# Altium schematic sheet SchemaDriverMoteur.SchDoc
size A4
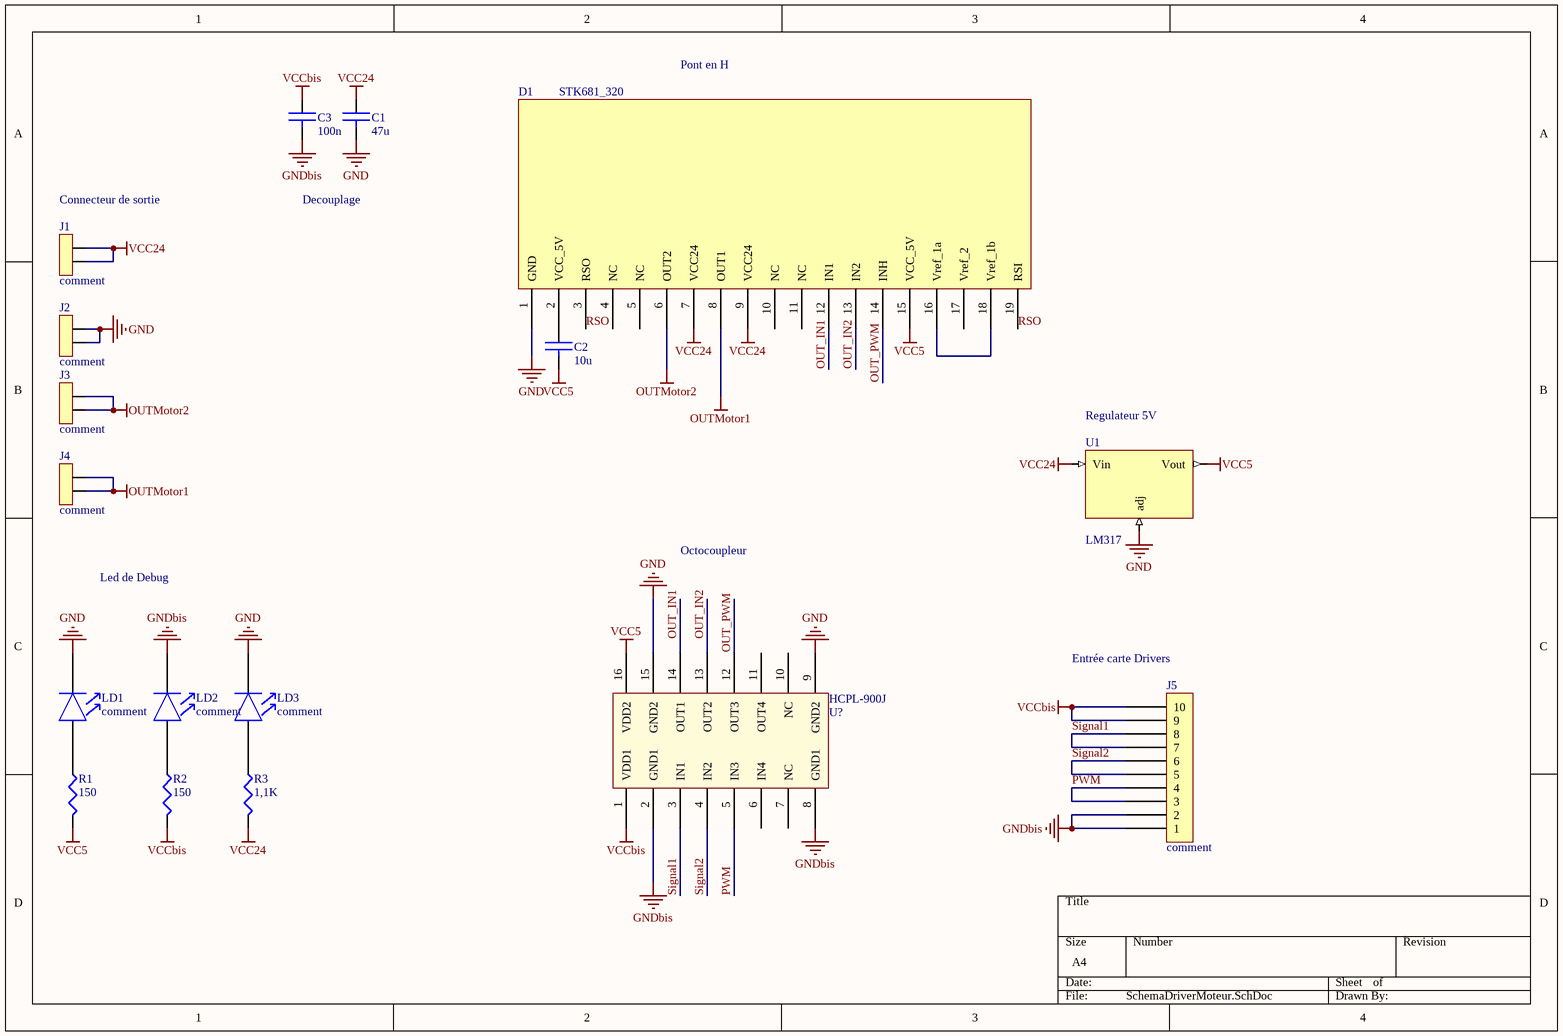
[diagram p0: SchemaDriverMoteur.SchDoc]

## Parts
C1  value 47u  [RAD0.1]  (hidden comment: CAP)
C2  value 10u  [RAD0.1]  (hidden comment: CAP)
C3  value 100n  [0805]  (hidden comment: CAP)
D1  STK681_320  [stk681_320]
HCPL-900J  U?  [HCPL-0900j]
J1  comment  [AMP_2]
J2  comment  [AMP_2]
J3  comment  [AMP_2]
J4  comment  [AMP_2]
J5  comment  [HE10-10V]
LD1  comment  [LED0805]
LD2  comment  [LED0805]
LD3  comment  [LED0805]
R1  value 150  [0805]  (hidden comment: RES)
R2  value 150  [0805]  (hidden comment: RES)
R3  value 1,1K  [0805]  (hidden comment: RES)
U1  LM317  [TO220V]

## Nets
GND: C1.2 D1.1(GND) HCPL-900J.9(GND2) HCPL-900J.15(GND2) J2.1 J2.2 LD1.K LD3.K U1.1(adj)
GNDbis: C3.2 HCPL-900J.2(GND1) HCPL-900J.8(GND1) J5.1 J5.2 LD2.K
OUTMotor1: D1.8(OUT1) J4.1 J4.2
OUTMotor2: D1.6(OUT2) J3.1 J3.2
VCC5: C2.2 D1.15(VCC_5V) HCPL-900J.16(VDD2) R1.2 U1.2(Vout)
VCC24: C1.1 D1.7(VCC24) D1.9(VCC24) J1.1 J1.2 R3.2 U1.3(Vin)
VCCbis: C3.1 HCPL-900J.1(VDD1) J5.9 J5.10 R2.2
OUT_IN1: D1.12(IN1) HCPL-900J.14(OUT1)
OUT_IN2: D1.13(IN2) HCPL-900J.13(OUT2)
OUT_PWM: D1.14(INH) HCPL-900J.12(OUT3)
PWM: HCPL-900J.5(IN3) J5.3 J5.4
RSO: D1.3(RSO) D1.19(RSI)
Signal1: HCPL-900J.3(IN1) J5.7 J5.8
Signal2: HCPL-900J.4(IN2) J5.5 J5.6
NetC2_1: C2.1 D1.2(VCC_5V)
NetD1_16: D1.16(Vref_1a) D1.18(Vref_1b)
NetLD1_A: LD1.A R1.1
NetLD2_A: LD2.A R2.1
NetLD3_A: LD3.A R3.1

Not connected (* = marked no-connect by the designer): D1 4(NC) 5(NC) 10(NC) 11(NC) 17(Vref_2); HCPL-900J 6(IN4) 7(NC) 10(NC) 11(OUT4)

## Notes on the sheet
- Pont en H
- (near J1) Connecteur de sortie
- Decouplage
- (near U1) Regulateur 5V
- Led de Debug
- Octocoupleur
- (near J5) Entrée carte Drivers

## Library data of the parts
C1-C3 = CAP: capacité non polarisée
HCPL-900J = HCPL-900J
J1-J4 = POWER2: connecteur alim 2 pôles
J5 = HE10-10: 10-pin connector
LD1-LD3 = LED: LED 5mm/3mm/CMS
R1-R3 = RES: resistance
U1 = REG_ADJ_POS: régulateur positif ajustable